# Altium schematic sheet Pressure.SchDoc
size A
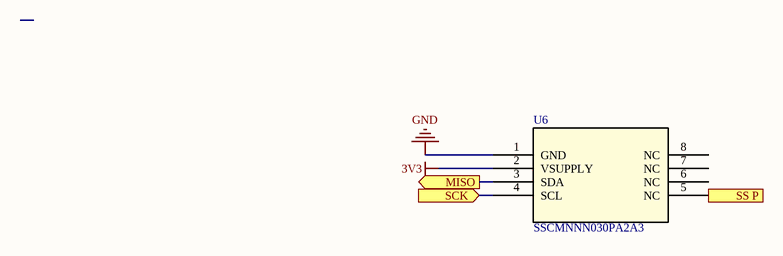
[diagram p0: Pressure.SchDoc]

## Parts
U6  SSCMNNN030PA2A3  [SSCMNN_HNW]

## Ports
MISO (out), SCK (in), SS P (in)

## Nets
3V3: U6.2(VSUPPLY)
GND: U6.1(GND)
MISO: U6.3(SDA) ; port MISO
SCK: U6.4(SCL) ; port SCK
SS P: U6.5(NC) ; port SS P

Not connected (* = marked no-connect by the designer): U6 6(NC) 7(NC) 8(NC)

## Library data of the parts
U6 = SSCMNNN030PA2A3: No Description Available; Vendor: Honeywell; Built_By: EMA_Cory; SourceLibrary: Honeywell_2020-09-30; Datasheet: https://sensing.honeywell.com/honeywell-sensing-trustability-ssc-series-standard-accuracy-board-mount-pressure-sensors-50099533-a-en.pdf; Manufacturer_Part_Number: SSCMNNN030PA2A3; Copyright: Copyright (C) 2018 Accelerated Designs. All rights reserved; RefDes: RefDes; Type: DEV